# Altium schematic sheet 3_DDR3.SchDoc
size A4
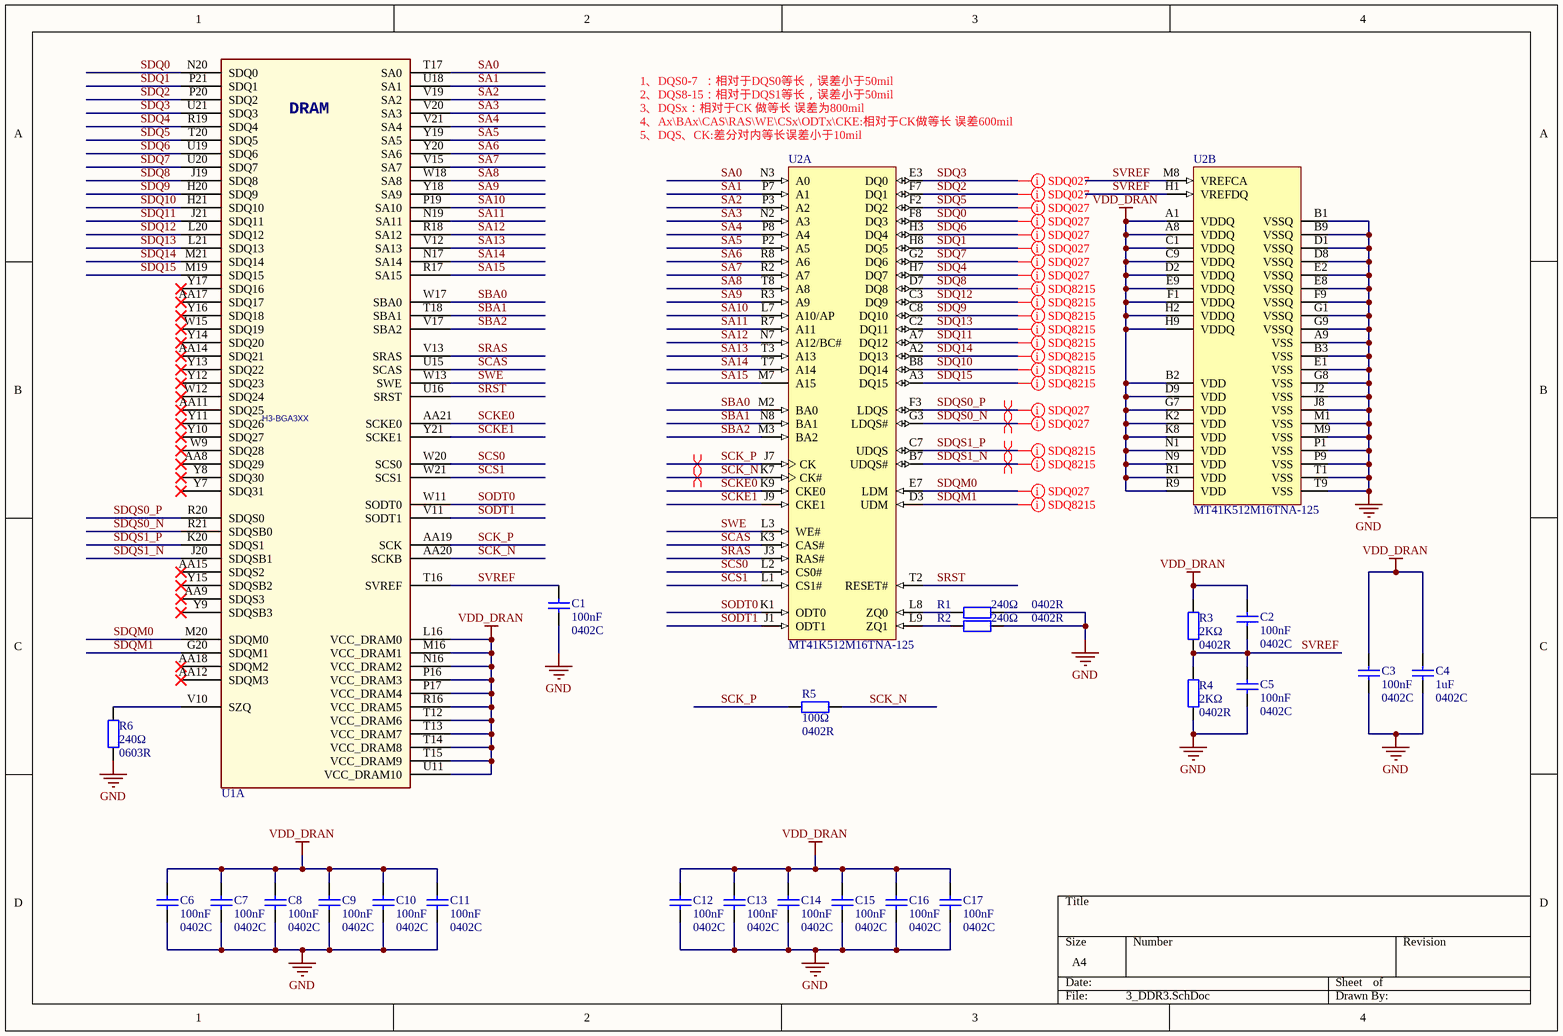
[diagram p0: 3_DDR3.SchDoc]

## Parts
C1  100nF  Package: 0402C  [0402_C]
C2  100nF  Package: 0402C  [0402_C]
C3  100nF  Package: 0402C  [0402_C]
C4  1uF  Package: 0402C  [0402_C]
C5  100nF  Package: 0402C  [0402_C]
C6  100nF  Package: 0402C  [0402_C]
C7  100nF  Package: 0402C  [0402_C]
C8  100nF  Package: 0402C  [0402_C]
C9  100nF  Package: 0402C  [0402_C]
C10  100nF  Package: 0402C  [0402_C]
C11  100nF  Package: 0402C  [0402_C]
C12  100nF  Package: 0402C  [0402_C]
C13  100nF  Package: 0402C  [0402_C]
C14  100nF  Package: 0402C  [0402_C]
C15  100nF  Package: 0402C  [0402_C]
C16  100nF  Package: 0402C  [0402_C]
C17  100nF  Package: 0402C  [0402_C]
R1  240Ω  Package: 0402R  [0402_R]
R2  240Ω  Package: 0402R  [0402_R]
R3  2KΩ  Package: 0402R  [0402_R]
R4  2KΩ  Package: 0402R  [0402_R]
R5  100Ω  Package: 0402R  [0402_R]
R6  240Ω  Package: 0603R  [0603_R]
U1  H3-BGA3XX  [BGA347P0_65B14X14]  (part A of 9)
U2  MT41K512M16TNA-125  [MICT-TNA-96]  (parts A,B of 2)

## Nets
GND: C1.1 C3.1 C4.1 C5.1 C6.1 C7.1 C8.1 C9.1 C10.1 C11.1 C12.1 C13.1 C14.1 C15.1 C16.1 C17.1 R1.1 R2.1 R4.2 R6.1 U2.A9(VSS) U2.B1(VSSQ) U2.B3(VSS) U2.B9(VSSQ) U2.D1(VSSQ) U2.D8(VSSQ) U2.E1(VSS) U2.E2(VSSQ) U2.E8(VSSQ) U2.F9(VSSQ) U2.G1(VSSQ) U2.G8(VSS) U2.G9(VSSQ) U2.J2(VSS) U2.J8(VSS) U2.M1(VSS) U2.M9(VSS) U2.P1(VSS) U2.P9(VSS) U2.T1(VSS) U2.T9(VSS)
VDD_DRAN: C2.2 C3.2 C4.2 C6.2 C7.2 C8.2 C9.2 C10.2 C11.2 C12.2 C13.2 C14.2 C15.2 C16.2 C17.2 R3.1 U1.L16(VCC_DRAM0) U1.M16(VCC_DRAM1) U1.N16(VCC_DRAM2) U1.P16(VCC_DRAM3) U1.P17(VCC_DRAM4) U1.R16(VCC_DRAM5) U1.T12(VCC_DRAM6) U1.T13(VCC_DRAM7) U1.T14(VCC_DRAM8) U1.T15(VCC_DRAM9) U1.U11(VCC_DRAM10) U2.A1(VDDQ) U2.A8(VDDQ) U2.B2(VDD) U2.C1(VDDQ) U2.C9(VDDQ) U2.D2(VDDQ) U2.D9(VDD) U2.E9(VDDQ) U2.F1(VDDQ) U2.G7(VDD) U2.H2(VDDQ) U2.H9(VDDQ) U2.K2(VDD) U2.K8(VDD) U2.N1(VDD) U2.N9(VDD) U2.R1(VDD) U2.R9(VDD)
SA0: U1.T17(SA0) U2.N3(A0)
SA1: U1.U18(SA1) U2.P7(A1)
SA2: U1.V19(SA2) U2.P3(A2)
SA3: U1.V20(SA3) U2.N2(A3)
SA4: U1.V21(SA4) U2.P8(A4)
SA5: U1.Y19(SA5) U2.P2(A5)
SA6: U1.Y20(SA6) U2.R8(A6)
SA7: U1.V15(SA7) U2.R2(A7)
SA8: U1.W18(SA8) U2.T8(A8)
SA9: U1.Y18(SA9) U2.R3(A9)
SA10: U1.P19(SA10) U2.L7(A10/AP)
SA11: U1.N19(SA11) U2.R7(A11)
SA12: U1.R18(SA12) U2.N7(A12/BC#)
SA13: U1.V12(SA13) U2.T3(A13)
SA14: U1.N17(SA14) U2.T7(A14)
SA15: U1.R17(SA15) U2.M7(A15)
SBA0: U1.W17(SBA0) U2.M2(BA0)
SBA1: U1.T18(SBA1) U2.N8(BA1)
SBA2: U1.V17(SBA2) U2.M3(BA2)
SCAS: U1.U15(SCAS) U2.K3(CAS#)
SCK_N: R5.1 U1.AA20(SCKB) U2.K7(CK#)
SCK_P: R5.2 U1.AA19(SCK) U2.J7(CK)
SCKE0: U1.AA21(SCKE0) U2.K9(CKE0)
SCKE1: U1.Y21(SCKE1) U2.J9(CKE1)
SCS0: U1.W20(SCS0) U2.L2(CS0#)
SCS1: U1.W21(SCS1) U2.L1(CS1#)
SDQ0: U1.N20(SDQ0) U2.F8(DQ3)
SDQ1: U1.P21(SDQ1) U2.H8(DQ5)
SDQ2: U1.P20(SDQ2) U2.F7(DQ1)
SDQ3: U1.U21(SDQ3) U2.E3(DQ0)
SDQ4: U1.R19(SDQ4) U2.H7(DQ7)
SDQ5: U1.T20(SDQ5) U2.F2(DQ2)
SDQ6: U1.U19(SDQ6) U2.H3(DQ4)
SDQ7: U1.U20(SDQ7) U2.G2(DQ6)
SDQ8: U1.J19(SDQ8) U2.D7(DQ8)
SDQ9: U1.H20(SDQ9) U2.C8(DQ10)
SDQ10: U1.H21(SDQ10) U2.B8(DQ14)
SDQ11: U1.J21(SDQ11) U2.A7(DQ12)
SDQ12: U1.L20(SDQ12) U2.C3(DQ9)
SDQ13: U1.L21(SDQ13) U2.C2(DQ11)
SDQ14: U1.M21(SDQ14) U2.A2(DQ13)
SDQ15: U1.M19(SDQ15) U2.A3(DQ15)
SDQM0: U1.M20(SDQM0) U2.E7(LDM)
SDQM1: U1.G20(SDQM1) U2.D3(UDM)
SDQS0_N: U1.R21(SDQSB0) U2.G3(LDQS#)
SDQS0_P: U1.R20(SDQS0) U2.F3(LDQS)
SDQS1_N: U1.J20(SDQSB1) U2.B7(UDQS#)
SDQS1_P: U1.K20(SDQS1) U2.C7(UDQS)
SODT0: U1.W11(SODT0) U2.K1(ODT0)
SODT1: U1.V11(SODT1) U2.J1(ODT1)
SRAS: U1.V13(SRAS) U2.J3(RAS#)
SRST: U1.U16(SRST) U2.T2(RESET#)
SVREF: C1.2 C2.1 C5.2 R3.2 R4.1 U1.T16(SVREF) U2.H1(VREFDQ) U2.M8(VREFCA)
SWE: U1.W13(SWE) U2.L3(WE#)
NetR1_2: R1.2 U2.L8(ZQ0)
NetR2_2: R2.2 U2.L9(ZQ1)
NetR6_2: R6.2 U1.V10(SZQ)

Not connected (* = marked no-connect by the designer): U1 AA8(SDQ29)* AA9(SDQS3)* AA11(SDQ25)* AA12(SDQM3)* AA14(SDQ21)* AA15(SDQS2)* AA17(SDQ17)* AA18(SDQM2)* W9(SDQ28)* W12(SDQ24)* W15(SDQ19)* Y7(SDQ31)* Y8(SDQ30)* Y9(SDQSB3)* Y10(SDQ27)* Y11(SDQ26)* Y12(SDQ23)* Y13(SDQ22)* Y14(SDQ20)* Y15(SDQSB2)* Y16(SDQ18)* Y17(SDQ16)*

## Layout directives
differential pair: SCK_N, SCK_P, SDQS0_N, SDQS0_P, SDQS1_N, SDQS1_P
net class Undefined: SDQ0, SDQ1, SDQ2, SDQ3, SDQ4, SDQ5, SDQ6, SDQ7, SDQ8, SDQ9, SDQ10, SDQ11, SDQ12, SDQ13, SDQ14, SDQ15, SDQM0, SDQM1, SDQS0_N, SDQS0_P, SDQS1_N, SDQS1_P

## Notes on the sheet
- (near U2) 1、DQS0-7  ：相对于DQS0等长，误差小于50mil
  2、DQS8-15：相对于DQS1等长，误差小于50mil
  3、DQSx：相对于CK 做等长 误差为800mil
  4、Ax\BAx\CAS\RAS\WE\CSx\ODTx\CKE:相对于CK做等长 误差600mil
  5、DQS、CK:差分对内等长误差小于10mil
- (in symbol H3-BGA3XX, part A) DRAM

## Library data of the parts
C1-C17 = 0402 1nF (102) 10% 50V: 贴片电容; ComponentLink1Description: 供应商链接; ComponentLink1URL: http://www.szlcsc.com/product/details_1875.html; Supplier: LC; SuppliersPartNumber: C1523
R1-R6 = 0402 1KΩ (1001) 1%: 贴片电阻; ComponentLink1Description: 供应商链接; ComponentLink1URL: http://www.szlcsc.com/product/details_12256.html; Supplier: LC; SuppliersPartNumber: C11702
U2 = MT41K512M16TNA-125: 8Gb SDRAM, 512Mb x 16, 1.25ns, 1.35V, 0 to 95 degC, 96-Ball FBGA, Pb-Free; Manufacturer: Micron; CL: CL = 11?; Clock Rate: 800 MHz?; Cycle Time: 1.25ns?; Density: 8Gb?; Op. Temp.: 0C to +95C?; Voltage: 1.35V?; DatasheetVersion: Rev. A; PackageVersion: Rev.E; PackageReference: MICT-TNA-96; PackageDescription: 96-Ball Fine-Pitch Ball Grid Array, 14 x 10 mm, Pitch 0.8 mm; Depth: 512Mb?; Package: FBGA?; Pin Count: 96-ball?; RoHS: Yes?; Width: x16?; Mounting Technology: Surface Mount; PartNumber: MT41K512M16TNA-125; ComponentLink1Description: Manufacturer URL; ComponentLink1URL: http://www.micron.com/; ComponentLink2Description: Datasheet; ComponentLink2URL: http://www.micron.com/~/media/Documents/Products/Data%20Sheet/DRAM/DDR3L_8Gb_x16_2CS_TwinDie_V80A.pdf; ComponentLink3Description: Package Specification; ComponentLink3URL: http://www.micron.com/~/media/Documents/Products/Data%20Sheet/DRAM/DDR3L-RS_8Gb_x16_2CS_TwinDie_V80A.pdf